# EAGLE design pc_healthypi_move_bottom_pcb_v2 (EAGLE 9.6.2)
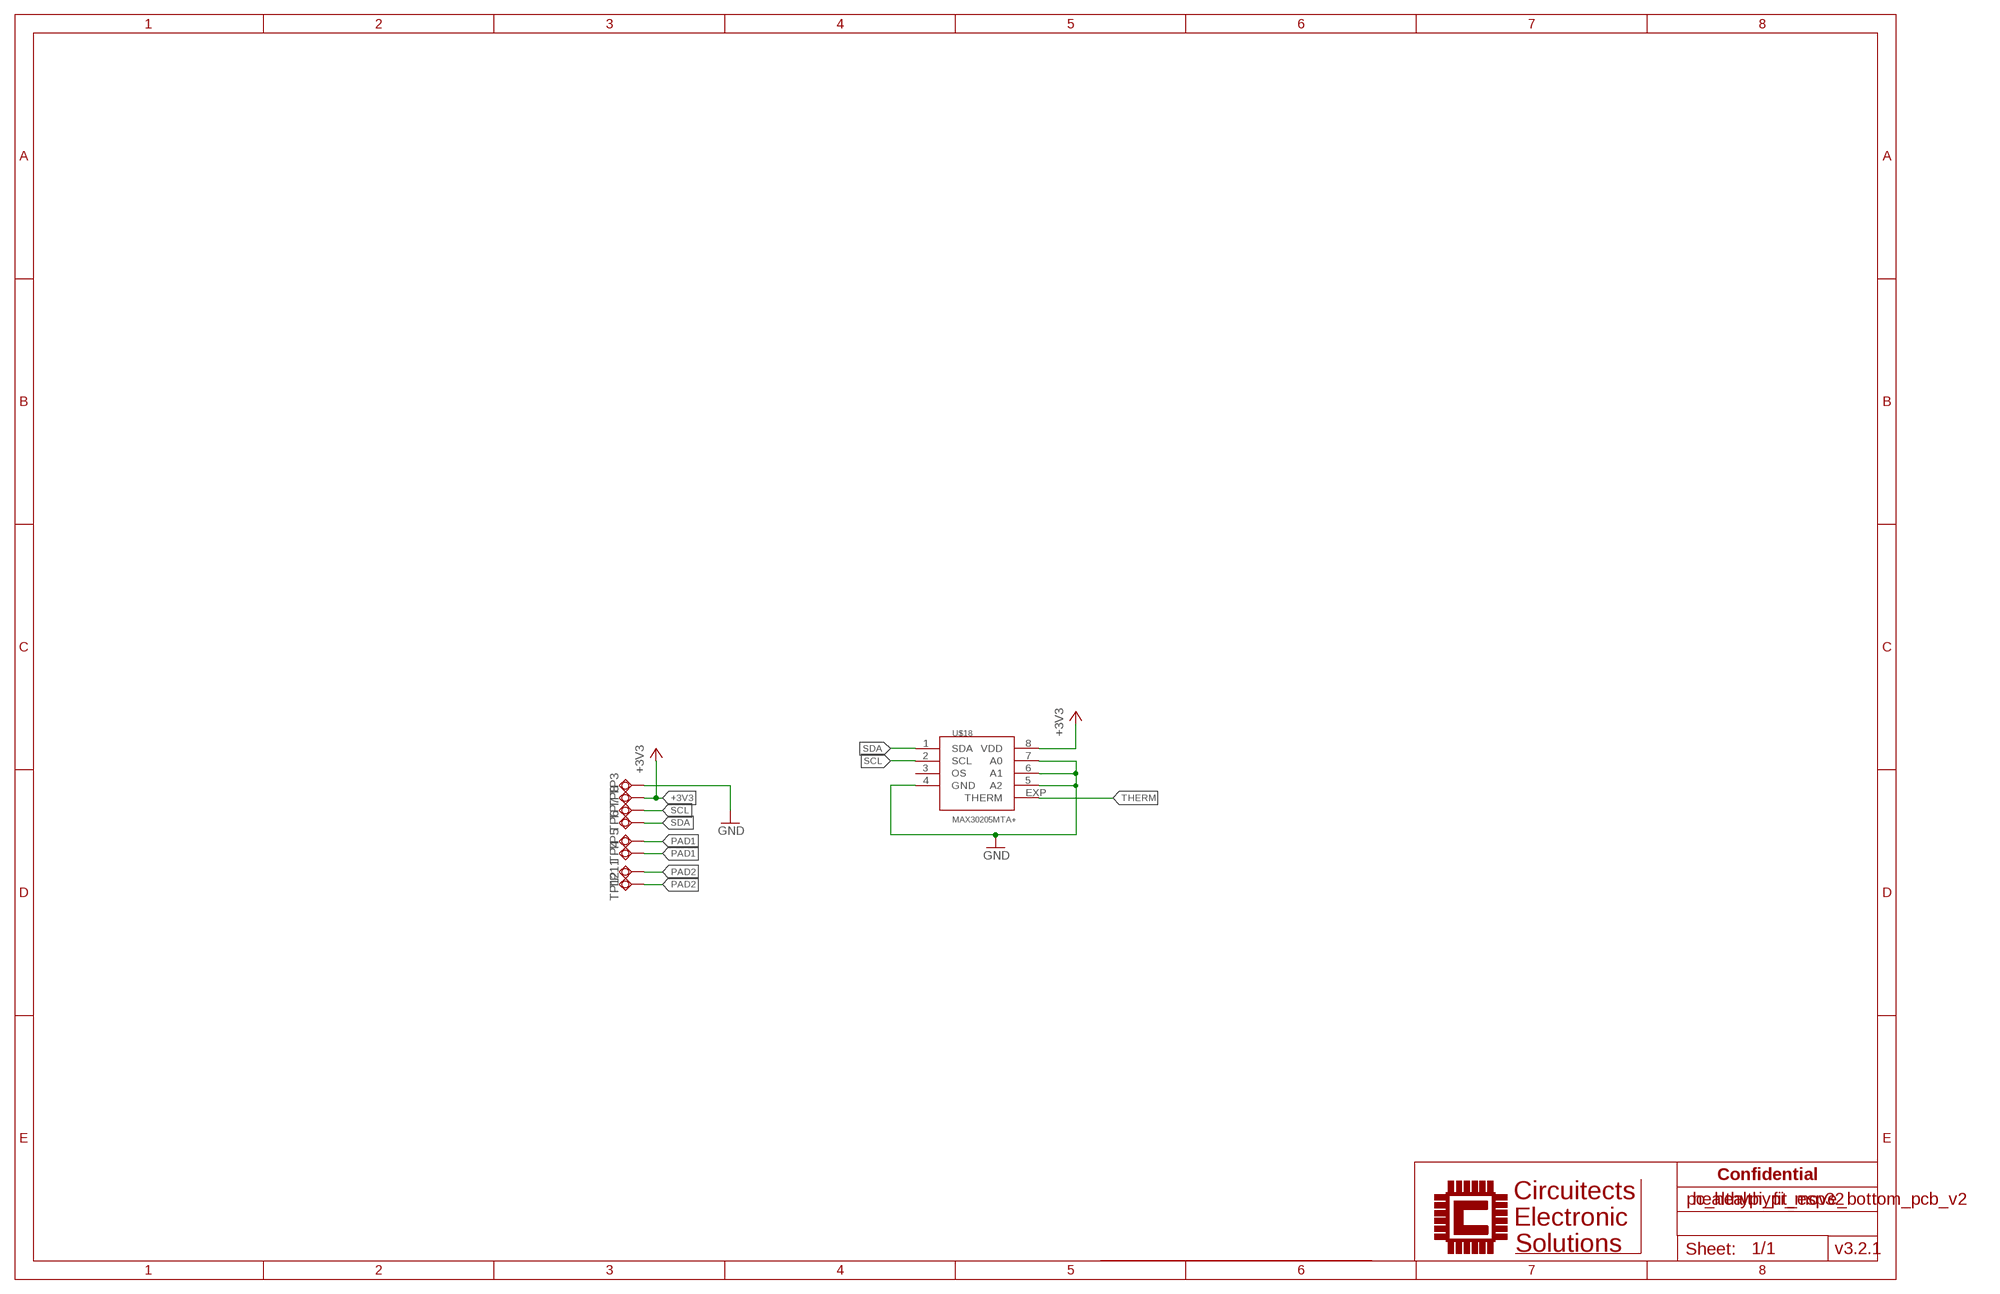
[diagram p0: schematic, sheet 1]

## Parts
TP3  TPSQTP20SQ  [TP20SQ]
TP4  TPSQTP20SQ  [TP20SQ]
TP5  TPSQTP20SQ  [TP20SQ]
TP6  TPSQTP20SQ  [TP20SQ]
TP7  TPSQTP20SQ  [TP20SQ]
TP8  TPSQTP20SQ  [TP20SQ]
TP11  TPSQTP20SQ  [TP20SQ]
TP12  TPSQTP20SQ  [TP20SQ]
U$18  MAX30205MTA+  [TDFN-08]

## Nets
+3V3: TP8.TP U$18.8(VDD)
GND: TP3.TP U$18.4(GND) U$18.5(A2) U$18.6(A1) U$18.7(A0)
PAD1: TP4.TP TP5.TP
PAD2: TP11.TP TP12.TP
SCL: TP7.TP U$18.2(SCL)
SDA: TP6.TP U$18.1(SDA)
THERM: U$18.EXP(THERM)
Unconnected: U$18.3(OS)

## Notes on the sheet
- Confidential
- healthypi_fit_esp32
- v3.2.1

## Library data of the parts
TP3-TP8 TP11 TP12 = testpad:TPSQ: Test pad
U$18 = circuitects:MAX30205

## Net classes
2 Clock: width 0.089 mm, clearance 0.178 mm

## Board
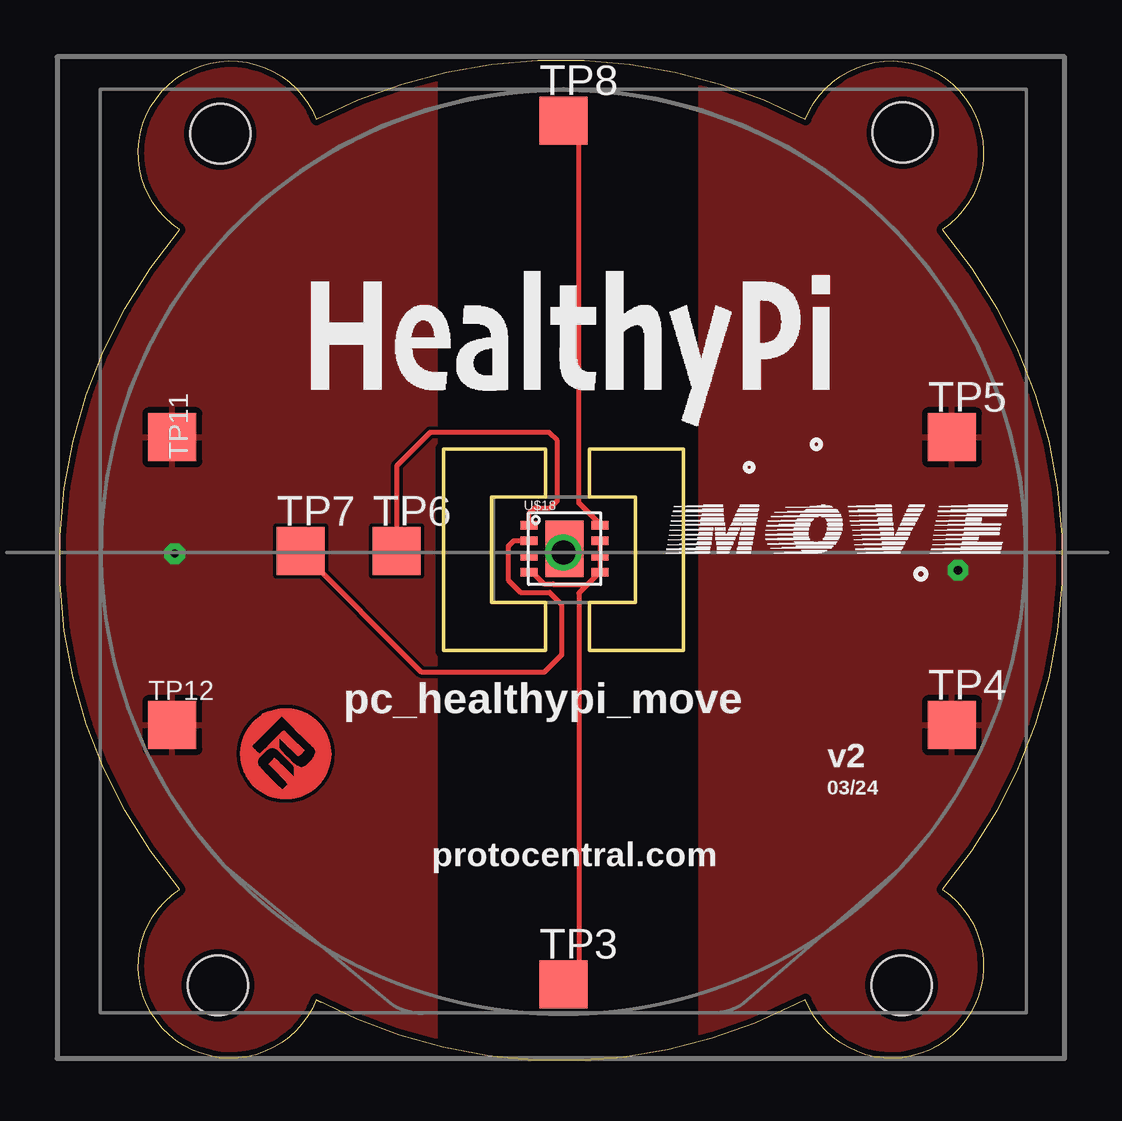
[diagram p1: board, top side]
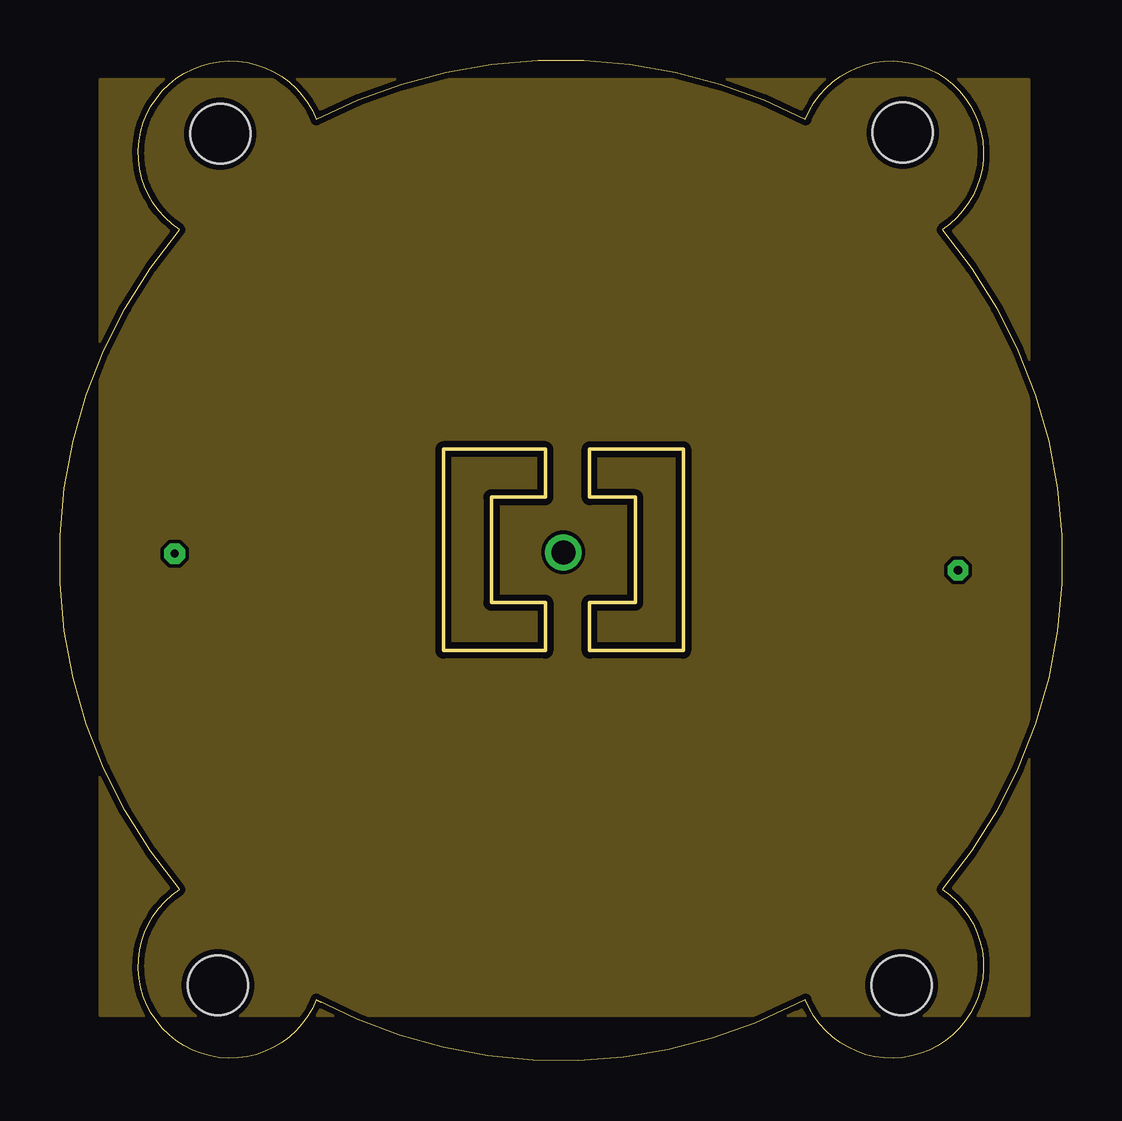
[diagram p2: board, inner layer Route2]
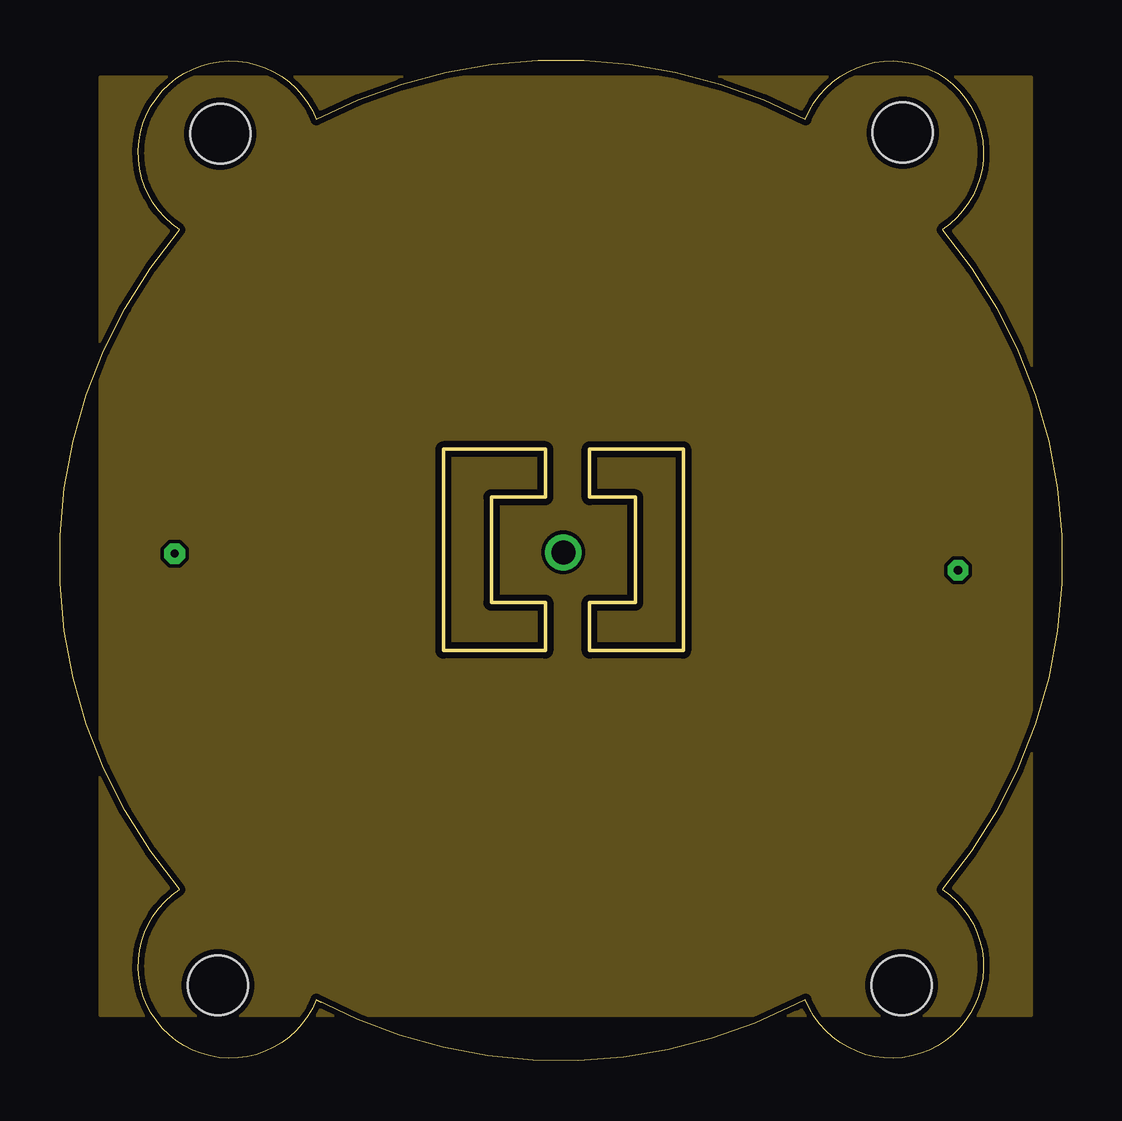
[diagram p3: board, inner layer Route15]
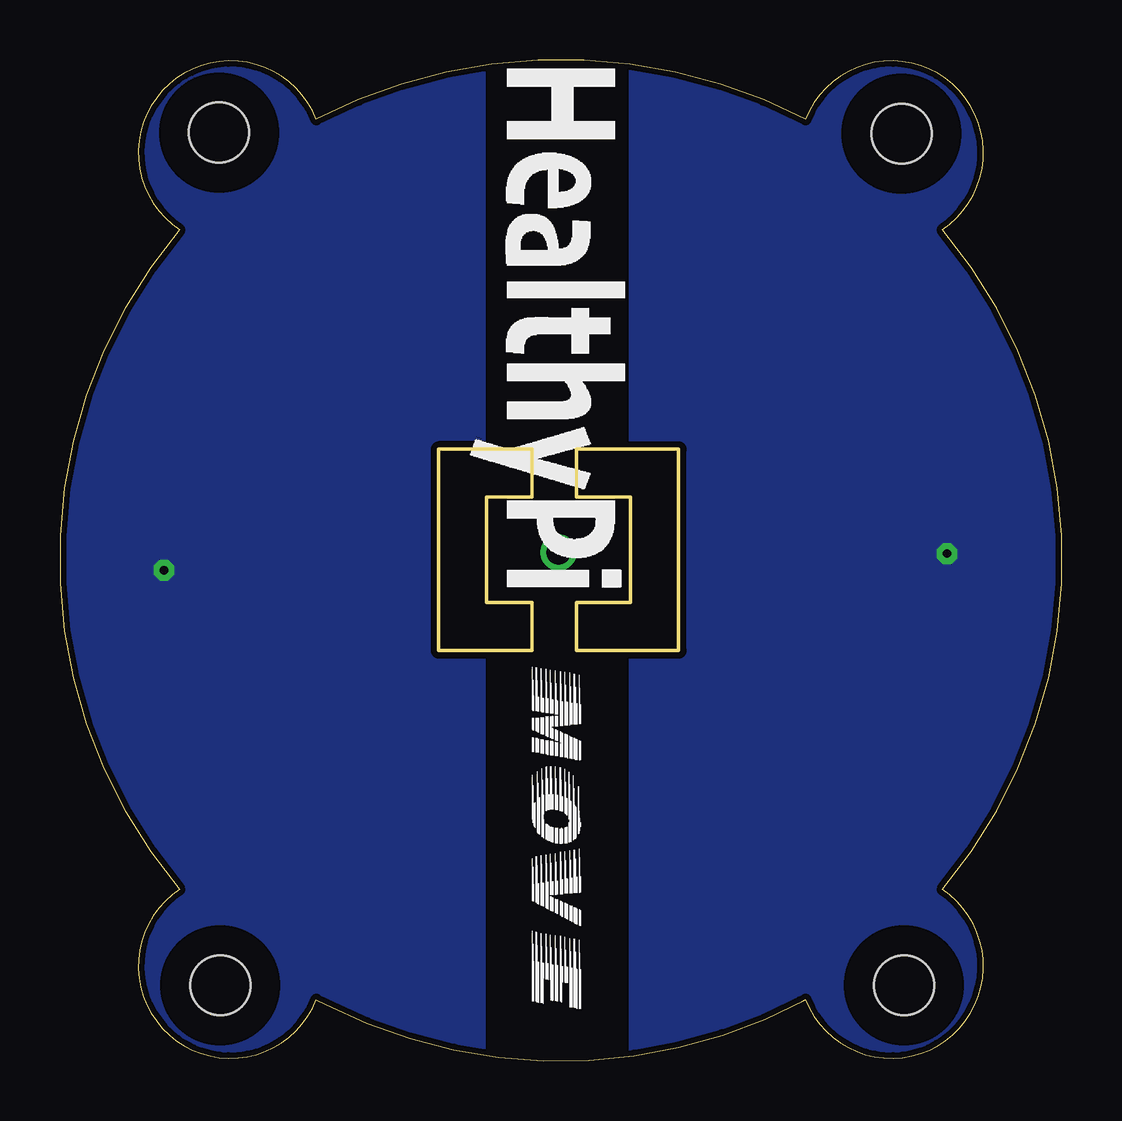
[diagram p4: board, bottom side, seen from below]

Size 41.76 x 41.71 mm. Coordinates in mm from the lower left corner, seen from the top.
Outline: 10.68,2.54 10.88,2.44
Outline: 10.68,2.54 arc55 30.68,2.34 31.08,2.54 arc215 36.78,7.14 arc80 36.78,34.64 arc215 31.08,39.24 arc55 10.68,39.24 arc215 4.98,34.64 arc80 4.98,7.14 arc215 10.68,2.54
Outline: 17.98,23.49 17.98,19.09 20.23,19.09 20.23,17.09 15.98,17.09 15.98,25.49 20.23,25.49 20.23,23.49 17.98,23.49
Outline: 22.08,19.09 23.98,19.09 23.98,23.49 22.08,23.49 22.08,25.49 25.98,25.49 25.98,17.09 22.08,17.09 22.08,19.09
Copper layers (1*16): Top 0.035mm / dielectric 1.5mm / Bottom 0.035mm
Design rules "Circuitects-Rules *": minimum track width 6mil, minimum drill 0.3mm, track to track 6mil, track to pad 6mil, pad to pad 6mil, via to via 6mil, smd to smd 6mil, copper to edge 10mil, drill to drill 8mil, minimum pad ring 12mil, minimum via ring 10mil, stop-mask expansion 4mil, vias tented up to drill 25mil, thermal gap 10mil
Holes 2.5 mm at 35.13,38.69 6.58,3.14 6.68,38.64 35.08,3.14
bRestrict: area 4.1,0.6 to 9.1,5.6; area 32.6,0.6 to 37.6,5.6; area 32.6,36.2 to 37.6,41.2; area 4.2,36.1 to 9.2,41.1

### Footprints (pad centres in the part's own frame; a part is rotated, then mirrored left to right if it is on the bottom)
TP20SQ = smd 2 x 2: TP 0,0
TDFN-08 = smd 0.7 x 0.35: 1 -1.475,0.975; 2 -1.475,0.325; 3 -1.475,-0.325; 4 -1.475,-0.975; 5 1.475,-0.975; 6 1.475,-0.325; 7 1.475,0.325; 8 1.475,0.975 | smd 1.58 x 2.35: EXP 0,0

### Placement (x,y rotation side)
TP3  20.98,3.19 0 top
TP4  37.18,13.99 0 top
TP5  37.18,25.99 0 top
TP6  14.03,21.24 0 top
TP7  10.03,21.24 0 top
TP8  20.98,39.19 0 top
TP11  4.68,25.99 0 top
TP12  4.68,13.99 0 top
U$2  [HEALTHYPI_MOVE_LOGO]  10.48,23.14 0 top
U$3  [HEALTHYPI_MOVE_LOGO_1]  24.43,18.54 0 top
U$5  [HEALTHYPI_MOVE_LOGO]  27.98,41.34 270 bottom
U$6  [HEALTHYPI_MOVE_LOGO_1]  24.68,17.24 270 bottom
U$18  21.03,21.34 0 top
U$51  [PCROUNDLOGO_GOLD]  6.58,10.54 0 top

### Tracks (layer width: path | path; a pad name or v marks a point on that pad's centre or on a via)
1.8V
  pour Route2: 40.38,40.89 1.68,40.89 1.68,1.89 40.38,1.89
+3V3
  Top 0.2: 20.88,39.09 21.63,38.34 21.63,23.24 22.51,22.36 U$18.8
  Top 0.254: 20.88,39.09 TP8.TP
GND
  Top 0.2: U$18.4 19.68,20.36 20.18,19.87 20.56,19.87 20.58,19.84 21.98,19.84 | 21.98,19.84 U$18.5 U$18.6 U$18.7 | 21.98,19.84 21.63,19.49 21.63,3.84 TP3.TP
  pour Route15: 40.48,40.99 1.68,40.99 1.68,1.89 40.48,1.89
PAD1  (via drill 0.35)
  other vias: 37.43,20.44
  pour Bottom: 24.08,41.89 41.88,41.89 41.88,0.09 24.08,0.09
  pour Top: 26.68,0.04 41.98,0.04 41.98,41.84 26.68,41.84
PAD2  (via drill 0.35)
  other vias: 4.78,21.14
  pour Bottom: -0.37,-0.08 17.98,-0.08 17.98,41.82 -0.37,41.82
  pour Top: -0.32,-0.11 15.68,-0.11 15.68,41.79 -0.32,41.79
SCL
  Top 0.2: U$18.2 18.91,21.66 18.68,21.44 18.68,20.04 19.2,19.52 20.41,19.52 20.91,19.01 20.91,16.92 20.18,16.19 15.08,16.19 TP7.TP
SDA
  Top 0.2: U$18.1 19.56,22.81 19.78,23.04 20.43,23.04 20.73,23.34 20.73,25.84 20.38,26.19 15.43,26.19 14.03,24.79 TP6.TP
THERM  (via drill 1)
  Top 0.254: U$18.EXP 21.03,21.24 v20.98,21.19

### Text on the board
tPlace: pc_healthypi_move | v2 | 03/24 | protocentral.com